# EAGLE design HVBoard (EAGLE 6.6.0)

## Sheet 1 of 6
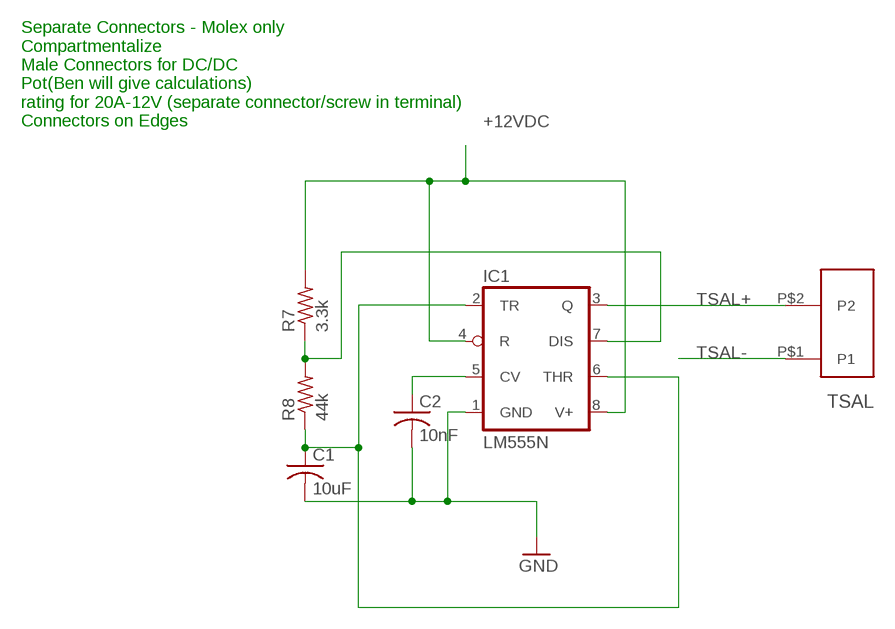
[diagram p0: schematic, sheet 1]

### Parts
C1  10uF  C-US025-025X050  [C025-025X050]
C2  10nF  C-US025-025X050  [C025-025X050]
IC1  LM555N  [DIL08]
R7  3.3k  R-US_0207/7  [0207/7]
R8  44k  R-US_0207/7  [0207/7]
TSAL  MINIFIT_2PIN  [2PIN_MOLEXMINIFIT]

### Nets
+12VDC: IC1.4(R) IC1.8(V+) R7.2 ; also sheet 4,6
GND: C1.2 C2.2 IC1.1(GND) ; also sheet 2,3,4,5,6
N$4: C1.1 IC1.2(TR) IC1.6(THR) R8.1
N$6: IC1.7(DIS) R7.1 R8.2
N$10: C2.1 IC1.5(CV)
TSAL+: IC1.3(Q) TSAL.P$2(P2)
TSAL-: TSAL.P$1(P1) ; also sheet 2

### Notes on the sheet
- Separate Connectors - Molex only
  Compartmentalize
  Male Connectors for DC/DC
  Pot(Ben will give calculations)
  rating for 20A-12V (separate connector/screw in terminal)
  Connectors on Edges

## Sheet 2 of 6
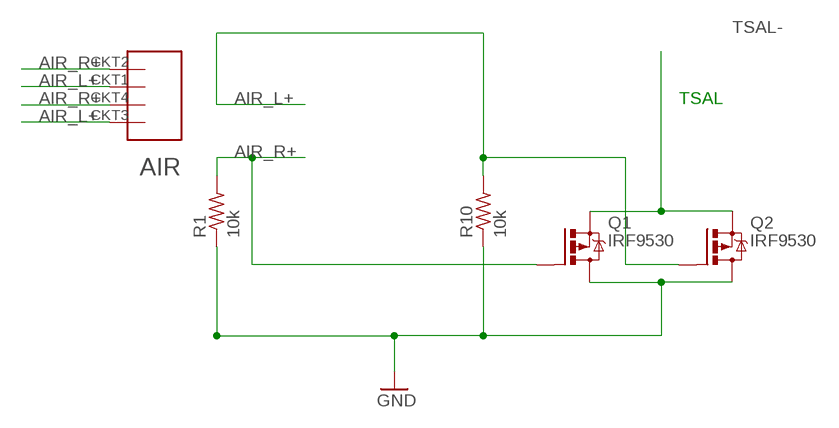
[diagram p1: schematic, sheet 2]

### Parts
AIR  MHYBRIDMOLEX  [MOLEXMINIFIT6]
Q1  IRF9530  [TO220BV]
Q2  IRF9530  [TO220BV]
R1  10k  R-US_0207/7  [0207/7]
R10  10k  R-US_0207/7  [0207/7]

### Nets
AIR_L+: AIR.CKT1(GND) AIR.CKT3(V_IN(12)) Q2.G R10.2
AIR_R+: AIR.CKT2(GND2) AIR.CKT4(V_IN2(12)) Q1.G R1.2
GND: Q1.D Q2.D R1.1 R10.1 ; also sheet 1,3,4,5,6
TSAL-: Q1.S Q2.S ; also sheet 1

### Notes on the sheet
- TSAL

## Sheet 3 of 6
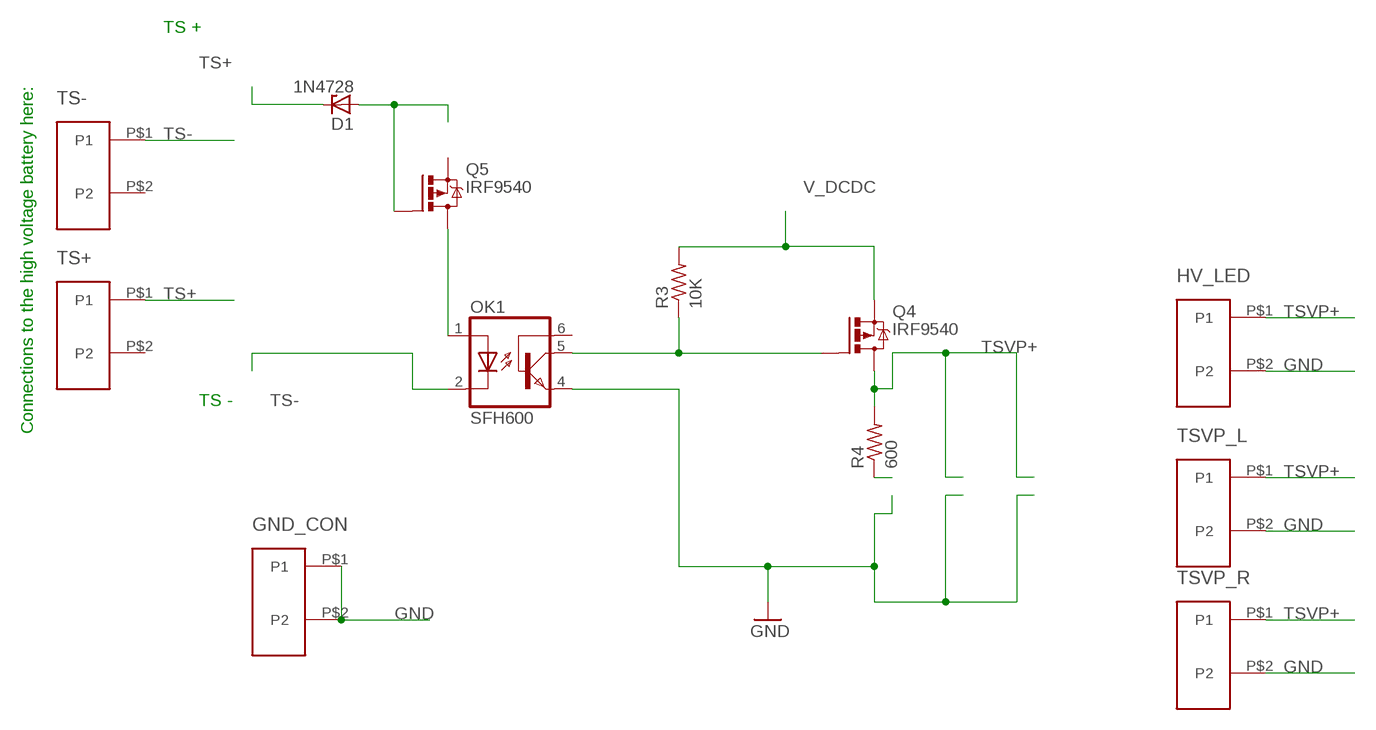
[diagram p2: schematic, sheet 3]

### Parts
D1  1N4728  [DO41Z10]
GND_CON  MINIFIT_2PIN  [2PIN_MOLEXMINIFIT]
HV_LED  MINIFIT_2PIN  [2PIN_MOLEXMINIFIT]
OK1  SFH600  [DIL06]
Q4  IRF9540  IRF9530  [TO220BV]
Q5  IRF9540  IRF9530  [TO220BV]
R3  10K  R-US_R0603  [R0603]
R4  600  R-US_R0603  [R0603]
TS+  MINIFIT_2PIN  [2PIN_MOLEXMINIFIT]
TS-  MINIFIT_2PIN  [2PIN_MOLEXMINIFIT]
TSVP_L  MINIFIT_2PIN  [2PIN_MOLEXMINIFIT]
TSVP_R  MINIFIT_2PIN  [2PIN_MOLEXMINIFIT]

### Nets
GND: GND_CON.P$1(P1) GND_CON.P$2(P2) HV_LED.P$2(P2) OK1.4(EMI) TSVP_L.P$2(P2) TSVP_R.P$2(P2) ; also sheet 1,2,4,5,6
N$1: R4.1
N$16: OK1.5(COL) Q4.G R3.1
TS+: D1.C TS+.P$1(P1) ; also sheet 6
TS+2: D1.A Q5.G
TS+3: OK1.1(A) Q5.D
TS-: OK1.2(C) TS-.P$1(P1) ; also sheet 6
TSVP+: HV_LED.P$1(P1) Q4.D R4.2 TSVP_L.P$1(P1) TSVP_R.P$1(P1)
V_DCDC: Q4.S R3.2 ; also sheet 6
Unconnected: OK1.6(BAS) Q5.S TS+.P$2(P2) TS-.P$2(P2)

### Notes on the sheet
- TS +
- Connections to the high voltage battery here:
- TS -

## Sheet 4 of 6
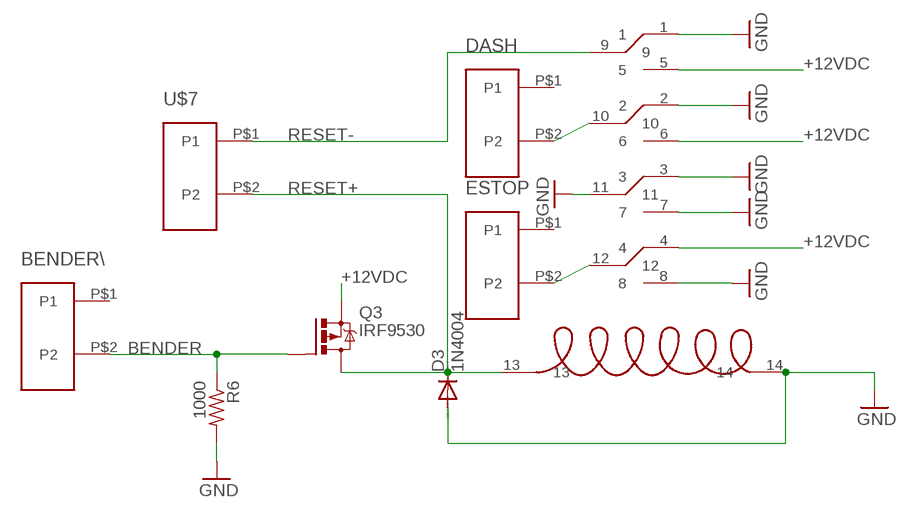
[diagram p3: schematic, sheet 4]

### Parts
BENDER\  MINIFIT_2PIN  [2PIN_MOLEXMINIFIT]
D3  1N4004  [DO41-10]
DASH  MINIFIT_2PIN  [2PIN_MOLEXMINIFIT]
ESTOP  MINIFIT_2PIN  [2PIN_MOLEXMINIFIT]
NEW??1  HJ4-DC12VHJ4-DC12V  [HJ4-DC12V]
Q3  IRF9530  [TO220BV]
R6  1000  R-US_M5923  [M5923]
U$7  MINIFIT_2PIN  [2PIN_MOLEXMINIFIT]

### Nets
+12VDC: NEW??1.4 NEW??1.5 NEW??1.6 Q3.S ; also sheet 1,6
BENDER: BENDER\.P$2(P2) Q3.G R6.1
GND: D3.A NEW??1.1 NEW??1.2 NEW??1.3 NEW??1.7 NEW??1.8 NEW??1.11 NEW??1.14 R6.2 ; also sheet 1,2,3,5,6
N$2: DASH.P$2(P2) NEW??1.10
N$3: ESTOP.P$2(P2) NEW??1.12
RESET+: D3.C NEW??1.13 Q3.D U$7.P$2(P2)
RESET-: NEW??1.9 U$7.P$1(P1)
Unconnected: BENDER\.P$1(P1) DASH.P$1(P1) ESTOP.P$1(P1)

## Sheet 5 of 6
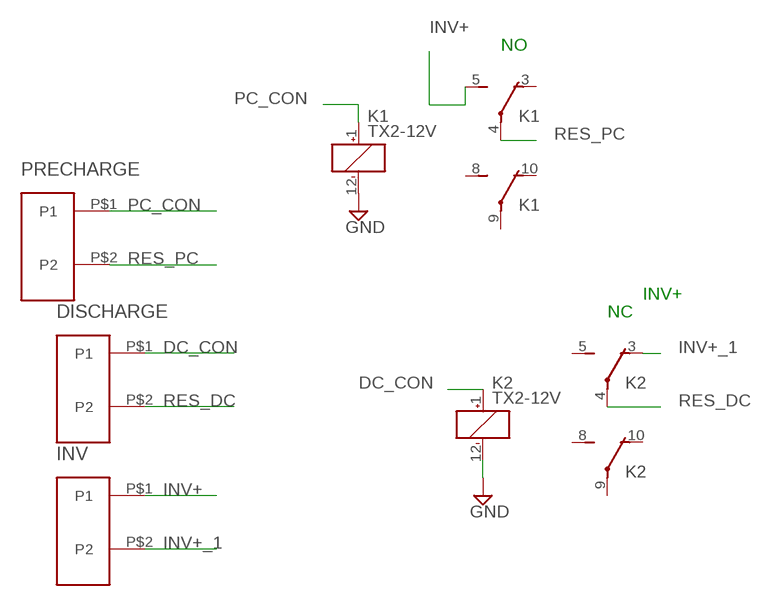
[diagram p4: schematic, sheet 5]

### Parts
DISCHARGE  MINIFIT_2PIN  [2PIN_MOLEXMINIFIT]
INV  MINIFIT_2PIN  [2PIN_MOLEXMINIFIT]
K1  TX2-12V  [TX2]
K2  TX2-12V  [TX2]
PRECHARGE  MINIFIT_2PIN  [2PIN_MOLEXMINIFIT]

### Nets
DC_CON: DISCHARGE.P$1(P1) K2.1(_:+)
GND: K1.12(_:-) K2.12(_:-) ; also sheet 1,2,3,4,6
INV+: INV.P$1(P1) K1.5(1:S)
INV+_1: INV.P$2(P2) K2.3(1:O)
PC_CON: K1.1(_:+) PRECHARGE.P$1(P1)
RES_DC: DISCHARGE.P$2(P2) K2.4(1:P)
RES_PC: K1.4(1:P) PRECHARGE.P$2(P2)
Unconnected: K1.3(1:O) K1.8(2:S) K1.9(2:P) K1.10(2:O) K2.5(1:S) K2.8(2:S) K2.9(2:P) K2.10(2:O)

### Notes on the sheet
- NO
- INV+
- NC

## Sheet 6 of 6
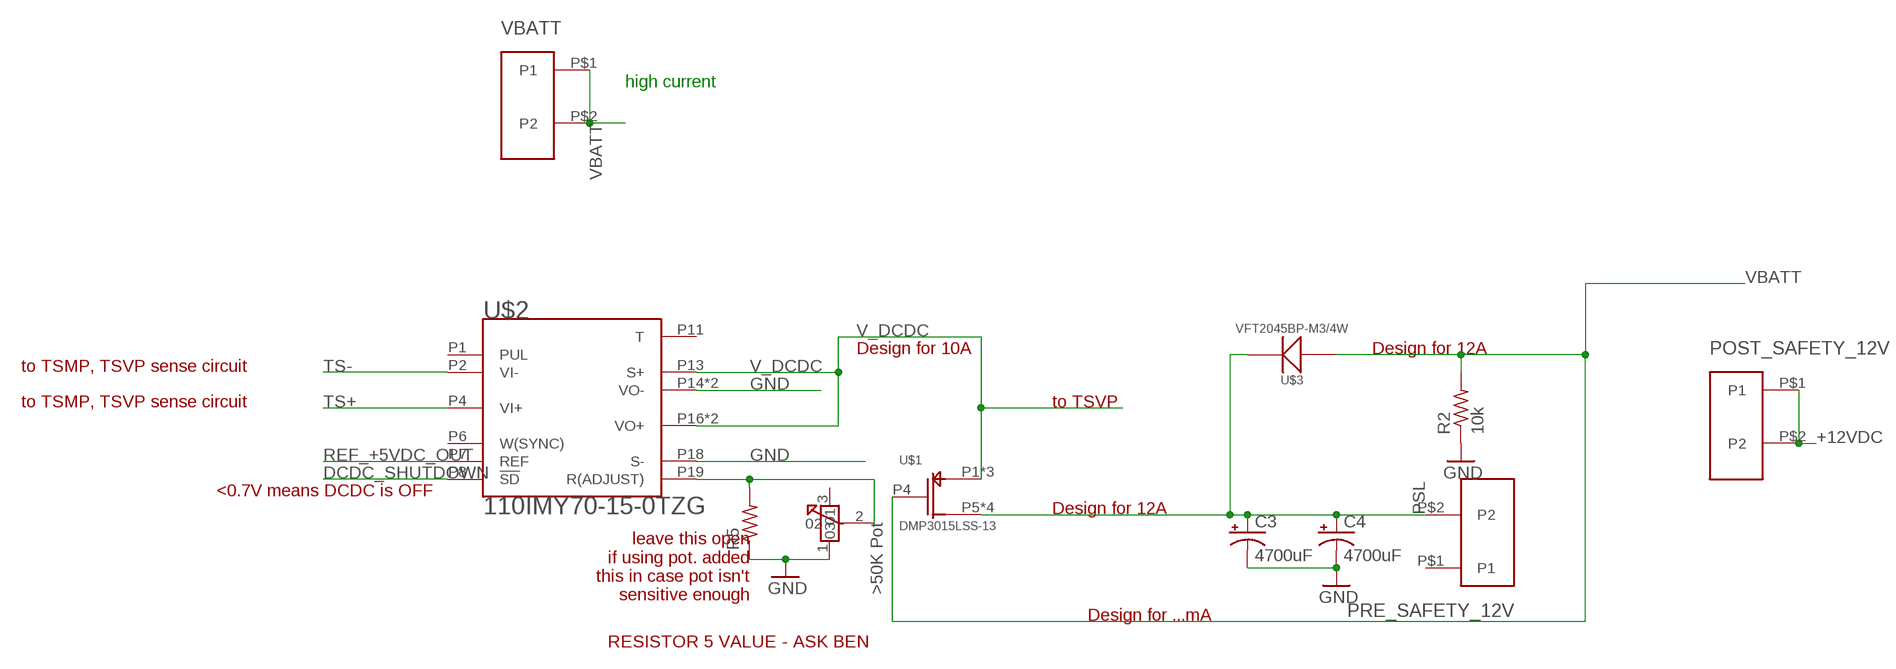
[diagram p5: schematic, sheet 6]

### Parts
C3  4700uF  CAP_POLPTH3  [CPOL-RADIAL-1000UF-63V]
C4  4700uF  CAP_POLPTH3  [CPOL-RADIAL-1000UF-63V]
POST_SAFETY_12V  MINIFIT_2PIN  [2PIN_MOLEXMINIFIT]
POT1  3310P-001-503L-NP  [3310P-001-503L-NP]
PRE_SAFETY_12V  MINIFIT_2PIN  [2PIN_MOLEXMINIFIT]
R2  10k  R-US_R0603  [R0603]
R5  R-US_R0805  [R0805]
U$1  DMP3015LSS-13  [8-SOP]
U$2  110IMY70-15-0TZG  [110IMY70-15-0TZG]
U$3  VFT2045BP-M3/4W  [VFT2045BP-M3/4W]
VBATT  MINIFIT_2PIN  [2PIN_MOLEXMINIFIT]

### Nets
+12VDC: POST_SAFETY_12V.P$1(P1) POST_SAFETY_12V.P$2(P2) ; also sheet 1,4
DCDC_SHUTDOWN: U$2.P8(!SD)
GND: C3.2(-) C4.2(-) POT1.1 R2.1 R5.1 U$2.P14(VO-) U$2.P15(VO-) U$2.P18(S-) ; also sheet 1,2,3,4,5
N$5: POT1.2 R5.2 U$2.P19(R(ADJUST))
PSL: C3.1(+) C4.1(+) PRE_SAFETY_12V.P$2(P2) U$1.P5(D) U$1.P6(D) U$1.P7(D) U$1.P8(D) U$3.P2
REF_+5VDC_OUT: U$2.P7(REF)
TS+: U$2.P4(VI+) ; also sheet 3
TS-: U$2.P2(VI-) ; also sheet 3
V_DCDC: U$1.P1(S) U$1.P2(S) U$1.P3(S) U$2.P13(S+) U$2.P16(VO+) U$2.P17(VO+) ; also sheet 3
VBATT: R2.2 U$1.P4(G) U$3.P1 VBATT.P$1(P1) VBATT.P$2(P2)
Unconnected: POT1.3 PRE_SAFETY_12V.P$1(P1) U$2.P1(PUL) U$2.P6(W(SYNC)) U$2.P11(T)

### Notes on the sheet
- high current
- Design for 10A | Design for 12A
- to TSMP, TSVP sense circuit
- to TSMP, TSVP sense circuit | to TSVP
- <0.7V means DCDC is OFF
- Design for 12A
- leave this open
  if using pot. added
  this in case pot isn't
  sensitive enough
- Design for ...mA
- RESISTOR 5 VALUE - ASK BEN

## Library data of the parts
AIR = mhybrid molex megaFit:MHYBRIDMOLEX
BENDER\ DASH DISCHARGE ESTOP GND_CON HV_LED INV POST_SAFETY_12V PRE_SAFETY_12V PRECHARGE TS+ TS- TSAL TSVP_L TSVP_R U$7 VBATT = mhybrid molex megaFit:MINIFIT_2PIN
C1 C2 = rcl:C-US: CAPACITOR, American symbol
C3 C4 = SparkFun-Capacitors:CAP_POL: Capacitor Polarized These are standard SMD and PTH capacitors. Normally 10uF, 47uF, and 100uF in electrolytic and tantalum varieties. Always verify the external diameter of the through hole cap, it varies with capacity, voltage, and manufacturer. The EIA devices should be standard.
D1 = diode:1N4728: Z DIODE 3.3 V, 1W, 5 percent
D3 = diode:1N4004: DIODE general purpose rectifier, 1 A
IC1 = linear:*555: TIMER
K1 K2 = relay:TX2?-*: 2 AMP. HIGH CAPACITY RELAY NAiS WITH HIGH SURGE VOLTAGE & HIGH BREAKDOWN VOLTAGE Source: http://www.mew-europe.com/.. en_ds_61022_0001.pdf; MF: AROMAT/ MATSUSHITA; MPN: TX2-12V; OC_FARNELL: 1200952; OC_NEWARK: 67K1295
NEW??1 = HJ4-DC12V:HJ4-DC12V
OK1 = optocoupler:SFH600: SIEMENS OPTO COUPLER; MF: VISHAY/TELEFUNKEN; MPN: SFH600-1; OC_FARNELL: 1469565; OC_NEWARK: 58K2178
POT1 = 3310P-001-503L-NP:3310P-001-503L-NP
Q1-Q5 = transistor-power:IRF9530: P-CHANNEL HEXFET POWER-MOS-FET Source: http://www.irf.com/product-info/datasheets/data/irf9530.pdf
R1 R5-R8 R10 = rcl:R-US_: RESISTOR, American symbol
R2-R4 = resistor:R-US_: RESISTOR, American symbol
U$1 = MHR15-GLV_PWR:DMP3015LSS-13: MOSFET P-CH 30V 13A 8-SOIC; DIGIKEY_PN: DMP3015LSSDICT-ND; MANUFACTURER: Diodes Incorporated; MFC_PN: DMP3015LSS-13
U$2 = MHR15-TS:110IMY70-15-0TZG: DC/DC CONVERTER 15V 90W
U$3 = MHR15-GLV_PWR:VFT2045BP-M3/4W: DIODE SCHOTTKY 45V 20A ITO220AC; DIGIKEY_PN: VFT2045BP-M3/4W-ND; MANUFACTURER: Vishay Semiconductor Diodes Division; MFC_PN: VFT2045BP-M3/4W

## Board
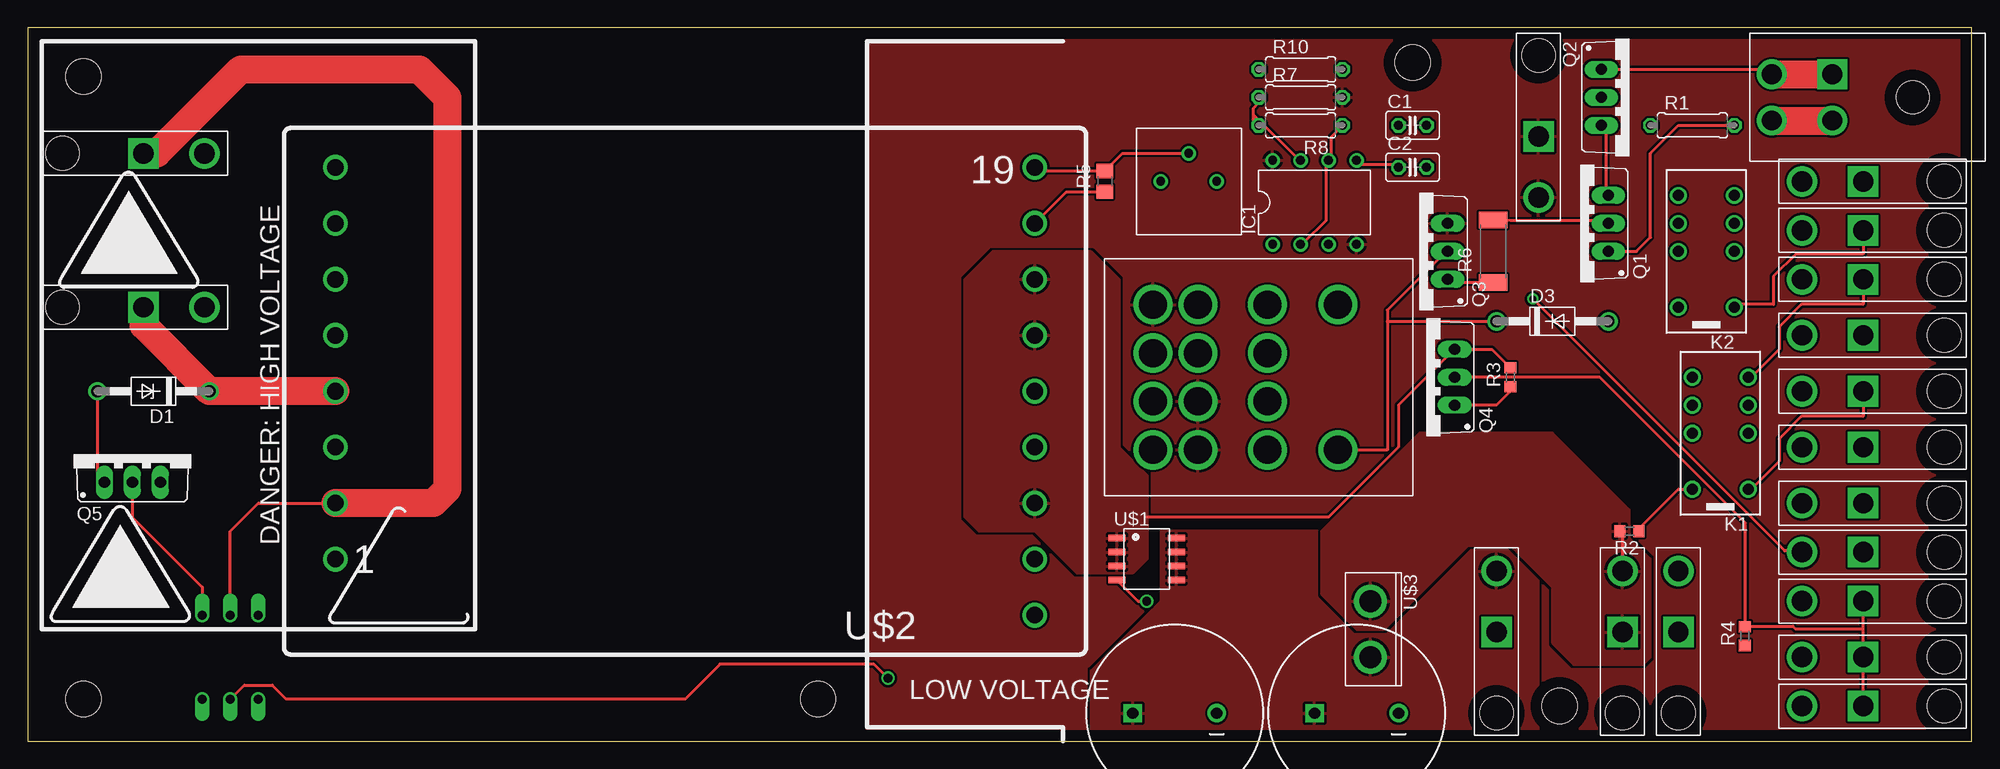
[diagram p6: board, top side]
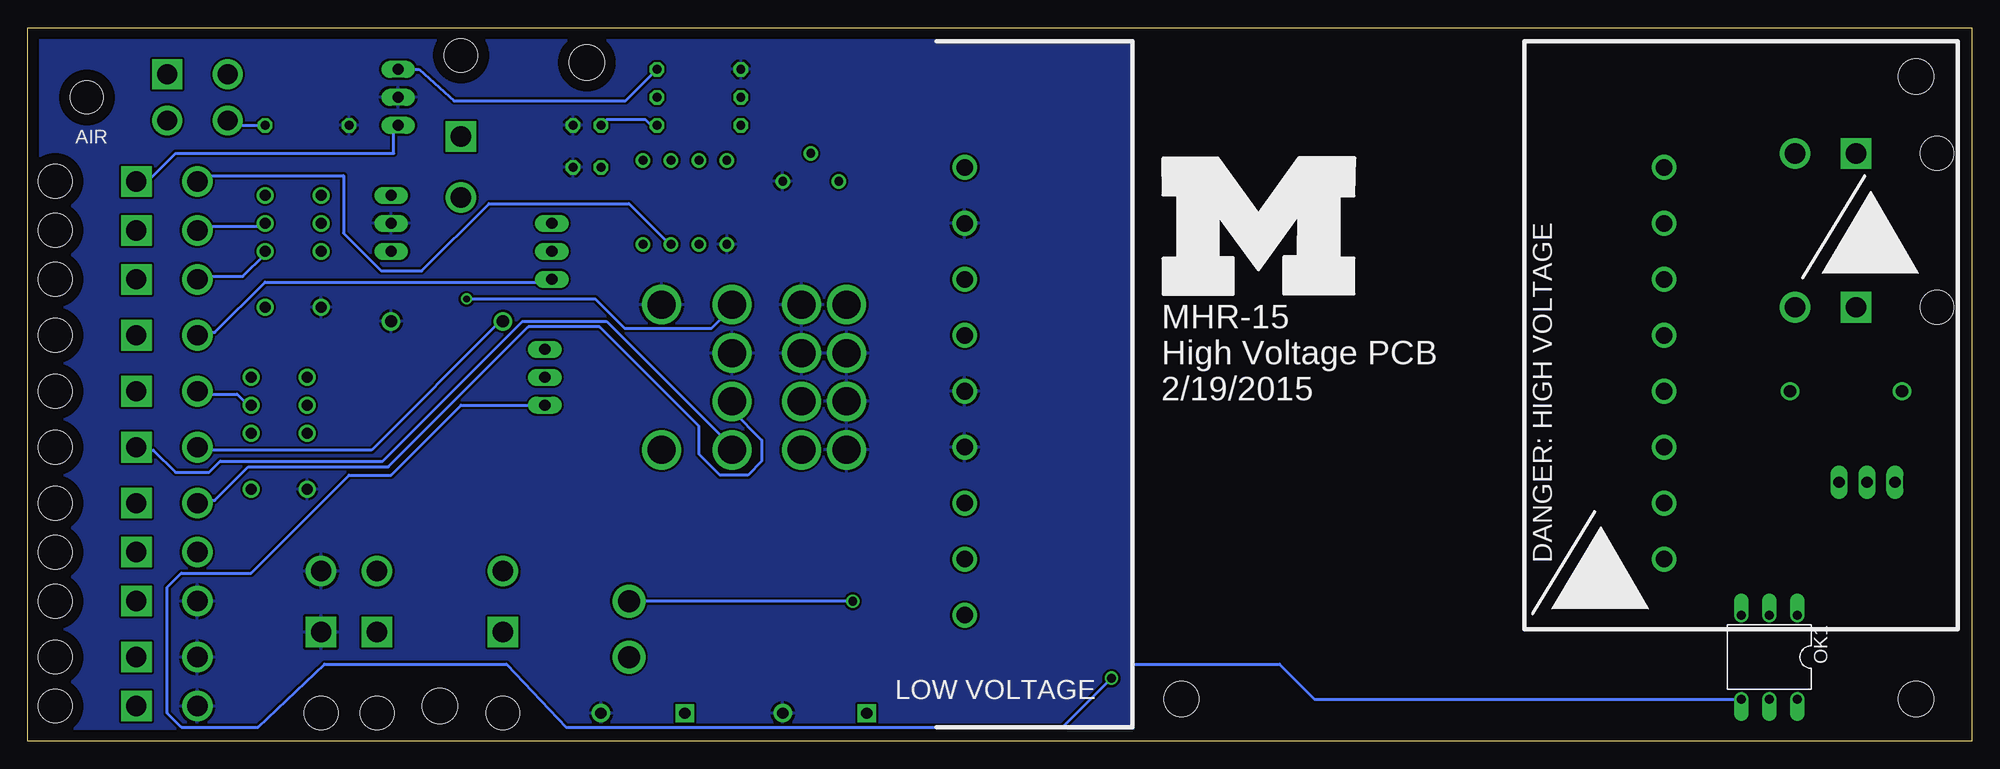
[diagram p7: board, bottom side, seen from below]

Size 176.51 x 64.76 mm. Coordinates in mm from the lower left corner, seen from the top.
Outline: 0,0 176.51,0 176.51,64.76 0,64.76 0,0
Copper layers (1*16): Top 0.035mm / dielectric 1.5mm / Bottom 0.035mm
Design rules "default": minimum track width 10mil, minimum drill 24mil, track to track 8mil, track to pad 8mil, pad to pad 8mil, via to via 8mil, smd to smd 8mil, copper to edge 40mil, drill to drill 8mil, minimum pad ring 10mil, minimum via ring 8mil, stop-mask expansion 4mil, vias tented up to drill 0mil, thermal gap 10mil
Holes 3.2 mm at 5.08,60.33 5.08,3.81 125.73,61.59 139.06,3.18 71.75,3.81

### Footprints (pad centres in the part's own frame; a part is rotated, then mirrored left to right if it is on the bottom)
MOLEXMINIFIT6 = drill 1.8 square: CKT1 2.1,0 | drill 1.8: CKT2 -2.1,0; CKT3 2.1,5.5; CKT4 -2.1,5.5 | hole 3: 0,-7.3
2PIN_MOLEXMINIFIT = drill 1.85 square: P$1 0,7.35 | drill 1.85: P$2 0,12.89 | hole 3.05: 0,0
C025-025X050 = drill 0.813 octagon: 1 -1.27,0; 2 1.27,0
CPOL-RADIAL-1000UF-63V = drill 1.016 pad 1.651 square: 1 3.81,0 | drill 1.016 pad 1.676: 2 -3.81,0
DO41Z10 = drill 1.118: A 5.08,0; C -5.08,0
DO41-10 = drill 1.118: A 5.08,0; C -5.08,0
DIL08 = drill 0.813 pad 1.27: 1 -3.81,-3.81; 2 -1.27,-3.81; 3 1.27,-3.81; 4 3.81,-3.81; 5 3.81,3.81; 6 1.27,3.81; 7 -1.27,3.81; 8 -3.81,3.81
TX2 = drill 1: 1 -5.08,-2.54; 3 0,-2.54; 4 2.54,-2.54; 5 5.08,-2.54; 8 5.08,2.54; 9 2.54,2.54; 10 0,2.54; 12 -5.08,2.54
HJ4-DC12V = drill 2.54: 1 -9.6,-6.6; 2 -9.6,-2.2; 3 -9.6,2.2; 4 -9.6,6.6; 5 -5.5,-6.6; 6 -5.5,-2.2; 7 -5.5,2.2; 8 -5.5,6.6; 9 0.8,-6.6; 10 0.8,-2.2; 11 0.8,2.2; 12 0.8,6.6; 13 7.2,-6.6; 14 7.2,6.6
DIL06 = drill 0.813 offset: 1 -2.54,-3.81; 2 0,-3.81; 3 2.54,-3.81; 4 2.54,3.81; 5 0,3.81; 6 -2.54,3.81
3310P-001-503L-NP = drill 0.8: 1 2.54,0; 2 0,2.54; 3 -2.54,0
TO220BV = drill 1.016 long: D 0,-2.54; G -2.54,-2.54; S 2.54,-2.54
0207/7 = drill 0.813 octagon: 1 -3.81,0; 2 3.81,0
R0603 = smd 1 x 1.1: 1 -0.85,0; 2 0.85,0
R0805 = smd 1.3 x 1.5: 1 -0.95,0; 2 0.95,0
M5923 = smd 1.5 x 2.6: 1 -2.85,0; 2 2.85,0
8-SOP = smd 0.6 x 1.55: P1 -1.905,-2.7; P2 -0.635,-2.7; P3 0.635,-2.7; P4 1.905,-2.7; P5 1.905,2.7; P6 0.635,2.7; P7 -0.635,2.7; P8 -1.905,2.7
110IMY70-15-0TZG = drill 1.5: P1 31.75,15.24; P2 31.75,10.16; P3 31.75,5.08; P4 31.75,0; P5 31.75,-5.08; P6 31.75,-10.16; P7 31.75,-15.24; P8 31.75,-20.32; P11 -31.75,20.32; P12 -31.75,15.24; P13 -31.75,10.16; P14 -31.75,5.08; P15 -31.75,0; P16 -31.75,-5.08; P17 -31.75,-10.16; P18 -31.75,-15.24; P19 -31.75,-20.32
VFT2045BP-M3/4W = drill 2: P1 -2.54,0; P2 2.54,0

### Placement (x,y rotation side)
AIR  163.83,58.42 90 top
BENDER\  173.99,36.83 90 top
C1  125.73,55.88 0 top
C2  125.73,52.07 0 top
C3  104.14,2.54 180 top
C4  120.65,2.54 180 top
D1  11.43,31.75 180 top
D3  138.43,38.1 0 top
DASH  173.99,21.59 90 top
DISCHARGE  173.99,46.35 90 top
ESTOP  173.99,17.14 90 top
GND_CON  149.86,2.54 0 top
HV_LED  173.99,12.7 90 top
IC1  116.84,48.89 0 top
INV  173.99,41.91 90 top
K1  153.67,27.94 90 top
K2  152.4,44.45 90 top
NEW??1  111.76,33.02 0 top
OK1  18.41,7.62 180 bottom
POST_SAFETY_12V  137.16,62.23 180 top
POT1  105.41,50.8 0 top
PRE_SAFETY_12V  133.35,2.54 0 top
PRECHARGE  173.99,31.75 90 top
Q1  140.97,46.99 90 top
Q2  145.41,58.42 270 top
Q3  126.36,44.45 90 top
Q4  127,33.02 90 top
Q5  9.53,26.04 0 top
R1  151.13,55.88 0 top
R2  145.41,19.05 180 top
R3  134.62,33.02 90 top
R4  155.89,9.53 90 top
R5  97.79,50.8 90 top
R6  133.03,44.45 90 top
R7  115.57,58.42 0 top
R8  115.57,55.88 180 top
R10  115.57,60.96 0 top
TS+  3.17,39.37 270 top
TS-  3.17,53.34 270 top
TSAL  173.99,50.8 90 top
TSVP_L  173.99,7.62 90 top
TSVP_R  173.99,3.18 90 top
U$1  101.6,16.51 270 top
U$2  59.69,31.75 180 top
U$3  121.92,10.16 270 top
U$7  173.99,26.67 90 top
VBATT  144.78,2.54 0 top

### Tracks (layer width: path | path; a pad name or v marks a point on that pad's centre or on a via)
+12VDC
  pour Top (rank 6): 76.2,-2.54 76.2,66.04 177.8,66.04 177.8,-2.54
AIR_L+
  Top 0.254: Q2.G 157.89,60.96 AIR.CKT3
  Top 2.54: AIR.CKT3 AIR.CKT1
  Bottom 0.254: Q2.G 140.97,60.96 137.79,58.1 122.24,58.1 R10.2
AIR_R+
  Top 0.254: Q1.G 146.05,44.45 147.32,45.72 147.32,53.34 149.86,55.88 R1.2
  Top 2.54: AIR.CKT4 AIR.CKT2
  Bottom 0.254: R1.2 157.99,55.88 AIR.CKT4
BENDER
  Top 0.254: Q3.G 129.54,41.66 132.98,41.66 R6.1
  Bottom 0.254: Q3.G 129.54,41.66 154.94,41.66 159.51,37.08 161.04,37.08 BENDER\.P$2
DC_CON
  Top 0.254: K2.1 154.94,39.62 158.5,39.62 158.5,42.16 160.53,44.2 166.62,44.2 166.62,46.23 DISCHARGE.P$1
GND
  Top 0.254: U$2.P18 94.3,49.85 R5.1 | R2.1 146.3,19.3 149.86,22.86 K1.12 | R6.2 134.62,47.24 142.24,47.24 Q1.D
  Bottom 0.254: 76.2,6.99 62.87,6.99 59.69,3.81 OK1.4
  pour Bottom: 76.2,-1.27 179.07,-1.27 179.07,66.04 76.2,66.04
INV+
  Top 0.254: K1.5 156.46,33.02 159,35.56 159,37.59 161.04,39.62 166.62,39.62 166.62,41.66 INV.P$1
INV+_1
  Bottom 0.254: K2.3 154.94,44.2 156.97,42.16 161.04,42.16 INV.P$2
N$2
  Bottom 0.254: DASH.P$2 161.04,21.84 159.51,21.84 156.46,24.89 143.76,24.89 131.06,37.59 124.59,37.59 115.57,28.57 115.57,26.04 113.67,24.13 111.12,24.13 109.86,25.4 109.86,27.3 112.56,30.01 NEW??1.10
N$3  (via drill 0.61)
  Top 0.254: v136.65,40.13 159.51,17.27 161.04,17.27 ESTOP.P$2
  Bottom 0.254: v136.65,40.13 124.97,40.13 122.3,37.46 114.43,37.46 113.79,38.1 113.73,38.16 112.78,39.12 NEW??1.12
N$4
  Top 0.254: IC1.2 115.82,45.21 117.86,47.24 117.86,52.32 IC1.6 118.36,52.83 118.36,54.86 R8.1
  Bottom 0.254: C1.1 123.95,56.39 120.4,56.39 119.89,55.88 R8.1
N$5
  Top 0.254: U$2.P19 91.76,51.75 R5.2 99.38,53.34 POT1.2
N$6
  Top 0.254: R8.2 111.25,56.39 111.25,56.9 | 111.25,56.9 111.25,57.4 111.76,57.91 R7.1 | 111.25,56.9 115.32,52.83 IC1.7
N$10
  Top 0.254: IC1.5 120.9,52.32 124.46,52.32 C2.1
N$16  (via drill 0.8)
  Top 0.254: R3.1 134.62,31.75 133.35,30.48 Q4.G | OK1.5 19.68,5.08 22.23,5.08 23.5,3.81 59.69,3.81 62.87,6.99 76.83,6.99 v78.11,5.71
  Bottom 0.254: Q4.G 137.16,30.48 143.51,24.13 147.32,24.13 156.21,15.24 162.56,15.24 163.83,13.97 163.83,2.54 162.56,1.27 155.57,1.27 149.54,6.99 133.03,6.99 127.64,1.27 82.55,1.27 v78.11,5.71
PC_CON
  Top 0.254: K1.1 156.46,22.86 159,25.4 159,27.43 161.04,29.46 166.62,29.46 166.62,31.5 PRECHARGE.P$1
PSL
  pour Top (rank 4): 102.87,19.05 102.87,12.7 96.52,6.35 96.52,-1.27 137.16,-1.27 137.16,14.61 132.72,19.05
RES_DC
  Bottom 0.254: K2.4 154.94,46.74 161.04,46.74 DISCHARGE.P$2
RES_PC
  Bottom 0.254: K1.4 156.46,30.48 157.48,31.5 161.04,31.5 PRECHARGE.P$2
RESET+
  Top 0.254: 123.44,38.1 123.44,39.12 128.52,44.2 128.65,44.2 Q3.D | 123.44,38.1 123.44,26.42 119.38,26.42 NEW??1.13 | 123.44,38.1 D3.C
  Bottom 0.254: U$7.P$2 161.04,26.42 145.29,26.42 133.6,38.1 D3.C
RESET-
  Bottom 0.254: NEW??1.9 112.78,26.92 123.95,38.1 131.57,38.1 144.27,25.4 159,25.4 160.02,24.38 163.07,24.38 165.1,26.42 166.62,26.42 U$7.P$1
TS+
  Top 2.54: U$2.P4 D1.C 10.53,37.73 TS+.P$1
TS+2
  Top 0.254: Q5.G 6.35,24.13 D1.A
TS+3
  Top 0.254: Q5.D 9.53,20.32 15.88,13.97 OK1.1
TS-
  Top 0.254: OK1.2 18.41,19.05 20.95,21.59 U$2.P2
  Top 2.54: U$2.P2 36.83,21.59 38.1,22.86 38.1,58.42 35.56,60.96 19.37,60.96 11.75,53.34 TS-.P$1
TSAL+
  Bottom 0.254: IC1.3 118.36,45.21 121.92,48.77 134.62,48.77 140.72,42.67 144.4,42.67 147.83,46.1 147.83,51.31 160.53,51.31 161.04,50.8 TSAL.P$2
TSAL-
  Top 0.254: Q1.S 143.26,49.78 143.26,55.88 Q2.S
  Bottom 0.254: TSAL.P$1 165.61,50.8 163.07,53.34 143.26,53.34 143.26,55.88 Q2.S
TSVP+
  Top 0.254: TSVP_R.P$1 TSVP_L.P$1 166.64,10.16 | 166.64,10.16 HV_LED.P$1 | 166.64,10.16 160.53,10.16 160.25,10.44 155.96,10.44 | Q4.D 142.75,33.02 155.96,19.81 155.96,10.44 | 155.96,10.44 R4.2
V_DCDC
  Top 0.254: R3.2 132.93,35.56 Q4.S 124.46,30.48 124.46,26.67 118.11,20.32 101.6,20.32
  pour Top (rank 2): 87.63,44.45 96.52,44.45 99.06,41.91 99.06,26.67 101.6,24.13 101.6,16.51 100.33,15.24 95.25,15.24 91.44,19.05 86.36,19.05 85.09,20.32 85.09,41.91
VBATT  (via drill 0.8)
  Top 0.254: R2.2 144.78,18.83 VBATT.P$2 | U$1.P4 100.81,12.7 v101.6,12.7
  Bottom 0.254: v101.6,12.7 U$3.P1
  pour Top (rank 3): 117.47,19.05 117.47,13.33 120.65,10.16 123.19,10.16 130.81,17.78 134.62,17.78 138.43,13.97 138.43,8.89 140.34,6.99 146.69,6.99 147.32,7.62 147.32,16.51 145.41,18.42 145.41,20.96 138.43,27.94 126.36,27.94

### Text on the board
tPlace: DANGER: HIGH VOLTAGE | LOW VOLTAGE
bNames: MHR-15 / High Voltage PCB / 2/19/2015 | DANGER: HIGH VOLTAGE | LOW VOLTAGE
bTest: //engin-labs.m.storage.umich.edu/mmaidani/windat.v2/Desktop/high_voltage_symbol.bmp